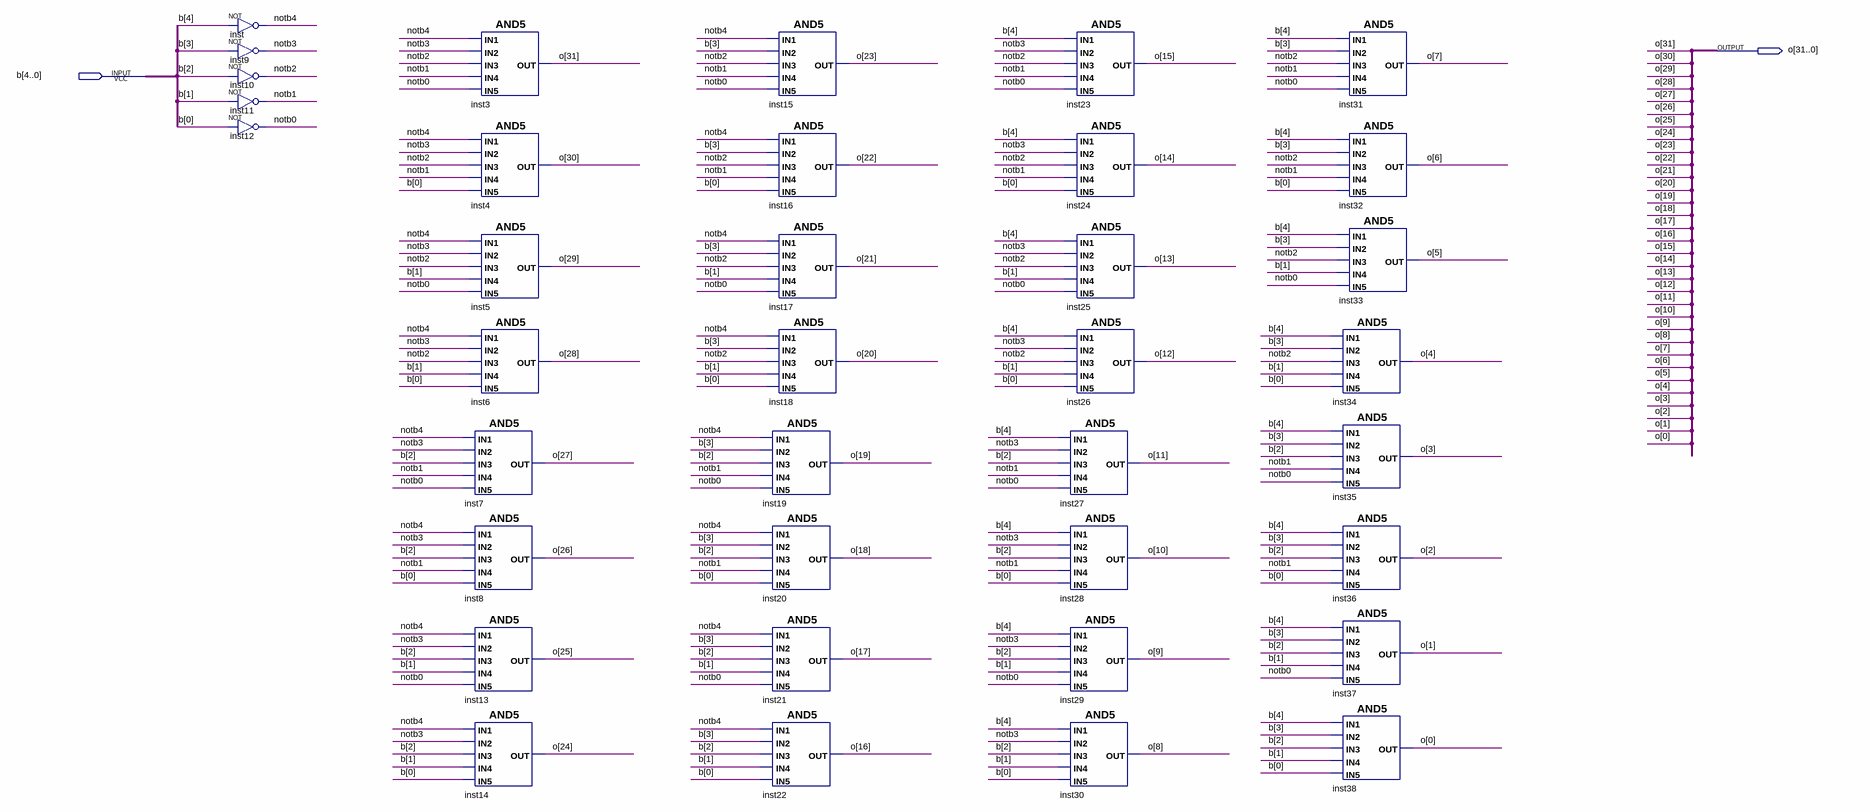
[diagram p0: schematic sheet]
// Quartus schematic decoderRAM.bdf as structural Verilog: 37 symbols, 2 pins
module decoderRAM (
  input  [4:0] b,
  output [31:0] o
);

  wire notb0, notb1, notb2, notb3, notb4;

  not inst (notb4, b[4]);
  not inst9 (notb3, b[3]);
  not inst10 (notb2, b[2]);
  not inst11 (notb1, b[1]);
  not inst12 (notb0, b[0]);
  and inst7 (o[27], notb4, notb3, b[2], notb1, notb0);
  and inst8 (o[26], notb4, notb3, b[2], notb1, b[0]);
  and inst13 (o[25], notb4, notb3, b[2], b[1], notb0);
  and inst14 (o[24], notb4, notb3, b[2], b[1], b[0]);
  and inst3 (o[31], notb4, notb3, notb2, notb1, notb0);
  and inst4 (o[30], notb4, notb3, notb2, notb1, b[0]);
  and inst5 (o[29], notb4, notb3, notb2, b[1], notb0);
  and inst6 (o[28], notb4, notb3, notb2, b[1], b[0]);
  and inst15 (o[23], notb4, b[3], notb2, notb1, notb0);
  and inst16 (o[22], notb4, b[3], notb2, notb1, b[0]);
  and inst17 (o[21], notb4, b[3], notb2, b[1], notb0);
  and inst18 (o[20], notb4, b[3], notb2, b[1], b[0]);
  and inst19 (o[19], notb4, b[3], b[2], notb1, notb0);
  and inst20 (o[18], notb4, b[3], b[2], notb1, b[0]);
  and inst21 (o[17], notb4, b[3], b[2], b[1], notb0);
  and inst22 (o[16], notb4, b[3], b[2], b[1], b[0]);
  and inst23 (o[15], b[4], notb3, notb2, notb1, notb0);
  and inst24 (o[14], b[4], notb3, notb2, notb1, b[0]);
  and inst25 (o[13], b[4], notb3, notb2, b[1], notb0);
  and inst26 (o[12], b[4], notb3, notb2, b[1], b[0]);
  and inst27 (o[11], b[4], notb3, b[2], notb1, notb0);
  and inst28 (o[10], b[4], notb3, b[2], notb1, b[0]);
  and inst29 (o[9], b[4], notb3, b[2], b[1], notb0);
  and inst30 (o[8], b[4], notb3, b[2], b[1], b[0]);
  and inst31 (o[7], b[4], b[3], notb2, notb1, notb0);
  and inst32 (o[6], b[4], b[3], notb2, notb1, b[0]);
  and inst33 (o[5], b[4], b[3], notb2, b[1], notb0);
  and inst34 (o[4], b[4], b[3], notb2, b[1], b[0]);
  and inst35 (o[3], b[4], b[3], b[2], notb1, notb0);
  and inst36 (o[2], b[4], b[3], b[2], notb1, b[0]);
  and inst37 (o[1], b[4], b[3], b[2], b[1], notb0);
  and inst38 (o[0], b[4], b[3], b[2], b[1], b[0]);
endmodule
